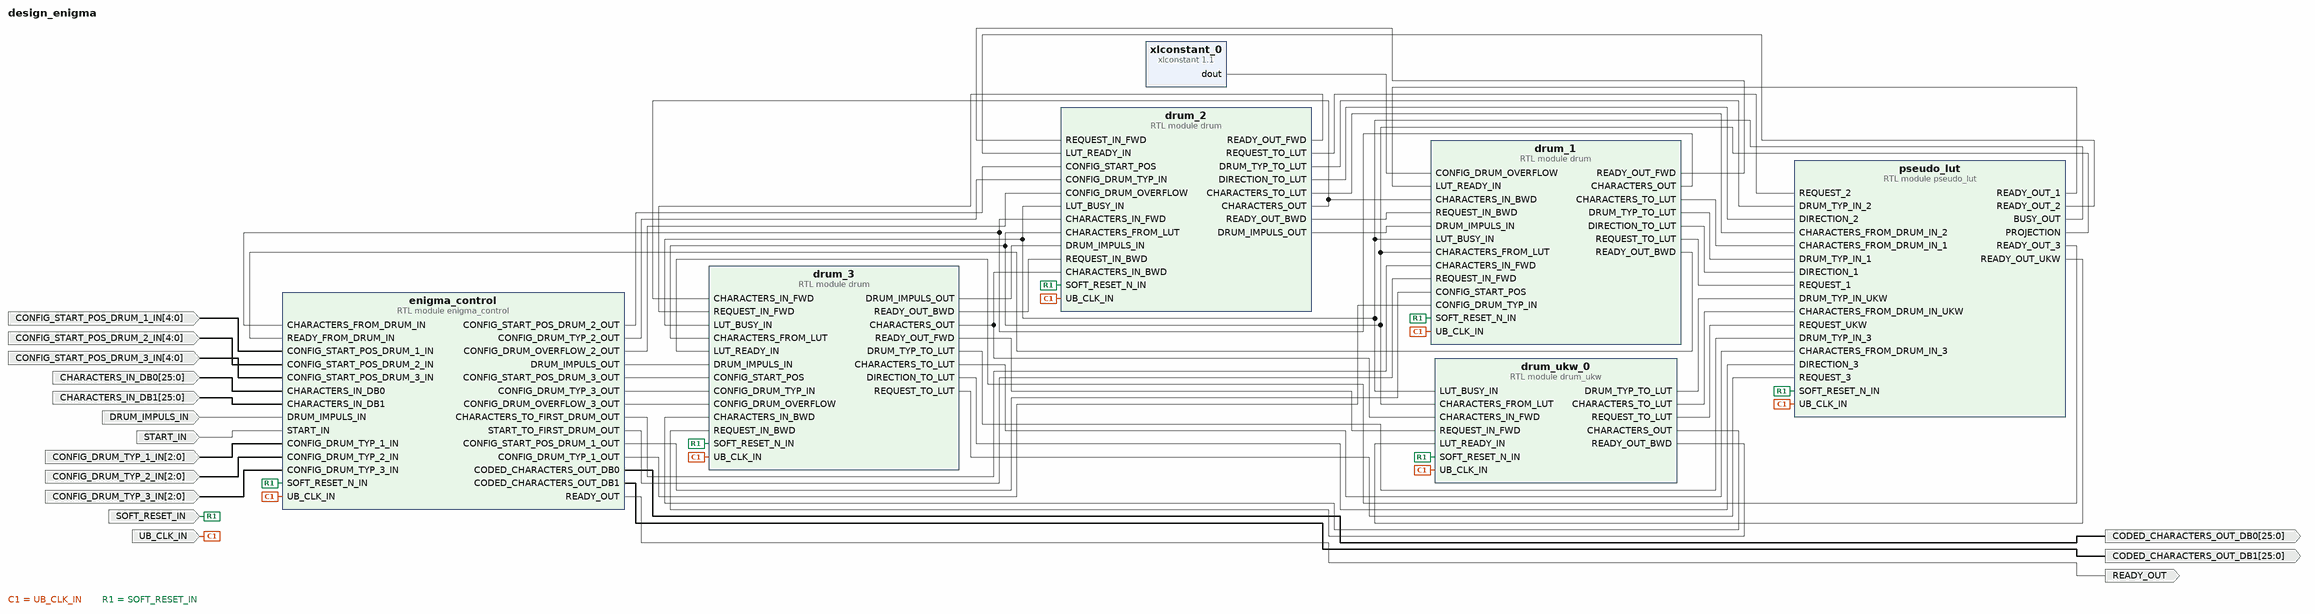
[diagram p0: block diagram of the top level]
# Vivado block design design_enigma, xc7z020clg400-1, Vivado 2018.3
create_bd_design design_enigma

create_bd_port -dir I -type clk UB_CLK_IN
set_property -dict {CONFIG.FREQ_HZ 100000000} [get_bd_ports UB_CLK_IN]
create_bd_port -dir I -type rst SOFT_RESET_IN
create_bd_port -dir I -from 4 -to 0 -type data CONFIG_START_POS_DRUM_1_IN
create_bd_port -dir I -from 4 -to 0 -type data CONFIG_START_POS_DRUM_2_IN
create_bd_port -dir I -from 4 -to 0 -type data CONFIG_START_POS_DRUM_3_IN
create_bd_port -dir I -from 25 -to 0 -type data CHARACTERS_IN_DB0
create_bd_port -dir I -from 25 -to 0 -type data CHARACTERS_IN_DB1
create_bd_port -dir I -type data DRUM_IMPULS_IN
create_bd_port -dir I -type data START_IN
create_bd_port -dir O -from 25 -to 0 -type data CODED_CHARACTERS_OUT_DB0
create_bd_port -dir O -from 25 -to 0 -type data CODED_CHARACTERS_OUT_DB1
create_bd_port -dir O -type data READY_OUT
create_bd_port -dir I -from 2 -to 0 -type data CONFIG_DRUM_TYP_1_IN
create_bd_port -dir I -from 2 -to 0 -type data CONFIG_DRUM_TYP_2_IN
create_bd_port -dir I -from 2 -to 0 -type data CONFIG_DRUM_TYP_3_IN

create_bd_cell -type ip -vlnv xilinx.com:ip:xlconstant:1.1 xlconstant_0
set_property -dict {CONFIG.CONST_VAL 0} [get_bd_cells xlconstant_0]
create_bd_cell -type module -reference pseudo_lut pseudo_lut
create_bd_cell -type module -reference drum drum_1
create_bd_cell -type module -reference drum drum_2
create_bd_cell -type module -reference drum drum_3
create_bd_cell -type module -reference drum_ukw drum_ukw_0
create_bd_cell -type module -reference enigma_control enigma_control

# ---- connections ----

connect_bd_net -net drum_0_CHARACTERS_TO_LUT [get_bd_pins drum_1/CHARACTERS_TO_LUT] [get_bd_pins pseudo_lut/CHARACTERS_FROM_DRUM_IN_1]
connect_bd_net -net drum_0_DRUM_TYP_TO_LUT [get_bd_pins drum_1/DRUM_TYP_TO_LUT] [get_bd_pins pseudo_lut/DRUM_TYP_IN_1]
connect_bd_net -net drum_0_DIRECTION_TO_LUT [get_bd_pins drum_1/DIRECTION_TO_LUT] [get_bd_pins pseudo_lut/DIRECTION_1]
connect_bd_net -net drum_0_REQUEST_TO_LUT [get_bd_pins drum_1/REQUEST_TO_LUT] [get_bd_pins pseudo_lut/REQUEST_1]
connect_bd_net -net drum_1_CHARACTERS_OUT [get_bd_pins drum_2/CHARACTERS_OUT] \
  [get_bd_pins drum_1/CHARACTERS_IN_BWD] [get_bd_pins drum_3/CHARACTERS_IN_FWD]
connect_bd_net -net drum_0_READY_OUT_FWD [get_bd_pins drum_1/READY_OUT_FWD] [get_bd_pins drum_2/REQUEST_IN_FWD]
connect_bd_net -net drum_1_READY_OUT_FWD [get_bd_pins drum_2/READY_OUT_FWD] [get_bd_pins drum_3/REQUEST_IN_FWD]
connect_bd_net -net drum_1_READY_OUT_BWD [get_bd_pins drum_2/READY_OUT_BWD] [get_bd_pins drum_1/REQUEST_IN_BWD]
connect_bd_net -net drum_1_DRUM_IMPULS_OUT [get_bd_pins drum_2/DRUM_IMPULS_OUT] [get_bd_pins drum_1/DRUM_IMPULS_IN]
connect_bd_net -net drum_2_DRUM_IMPULS_OUT [get_bd_pins drum_3/DRUM_IMPULS_OUT] [get_bd_pins drum_2/DRUM_IMPULS_IN]
connect_bd_net -net pseudo_lut_0_READY_OUT_1 [get_bd_pins pseudo_lut/READY_OUT_1] [get_bd_pins drum_1/LUT_READY_IN]
connect_bd_net -net pseudo_lut_0_BUSY_OUT [get_bd_pins pseudo_lut/BUSY_OUT] \
  [get_bd_pins drum_1/LUT_BUSY_IN] [get_bd_pins drum_2/LUT_BUSY_IN] [get_bd_pins drum_3/LUT_BUSY_IN] \
  [get_bd_pins drum_ukw_0/LUT_BUSY_IN]
connect_bd_net -net pseudo_lut_0_PROJECTION [get_bd_pins pseudo_lut/PROJECTION] \
  [get_bd_pins drum_1/CHARACTERS_FROM_LUT] [get_bd_pins drum_2/CHARACTERS_FROM_LUT] [get_bd_pins drum_3/CHARACTERS_FROM_LUT] \
  [get_bd_pins drum_ukw_0/CHARACTERS_FROM_LUT]
connect_bd_net -net pseudo_lut_0_READY_OUT_2 [get_bd_pins pseudo_lut/READY_OUT_2] [get_bd_pins drum_2/LUT_READY_IN]
connect_bd_net -net pseudo_lut_0_READY_OUT_3 [get_bd_pins pseudo_lut/READY_OUT_3] [get_bd_pins drum_3/LUT_READY_IN]
connect_bd_net -net pseudo_lut_0_READY_OUT_UKW [get_bd_pins pseudo_lut/READY_OUT_UKW] [get_bd_pins drum_ukw_0/LUT_READY_IN]
connect_bd_net -net drum_2_READY_OUT_BWD [get_bd_pins drum_3/READY_OUT_BWD] [get_bd_pins drum_2/REQUEST_IN_BWD]
connect_bd_net -net drum_2_CHARACTERS_OUT [get_bd_pins drum_3/CHARACTERS_OUT] \
  [get_bd_pins drum_2/CHARACTERS_IN_BWD] [get_bd_pins drum_ukw_0/CHARACTERS_IN_FWD]
connect_bd_net -net drum_1_REQUEST_TO_LUT [get_bd_pins drum_2/REQUEST_TO_LUT] [get_bd_pins pseudo_lut/REQUEST_2]
connect_bd_net -net drum_2_READY_OUT_FWD [get_bd_pins drum_3/READY_OUT_FWD] [get_bd_pins drum_ukw_0/REQUEST_IN_FWD]
connect_bd_net -net drum_2_DRUM_TYP_TO_LUT [get_bd_pins drum_3/DRUM_TYP_TO_LUT] [get_bd_pins pseudo_lut/DRUM_TYP_IN_3]
connect_bd_net [get_bd_pins drum_ukw_0/DRUM_TYP_TO_LUT] [get_bd_pins pseudo_lut/DRUM_TYP_IN_UKW]
connect_bd_net -net drum_1_DRUM_TYP_TO_LUT [get_bd_pins drum_2/DRUM_TYP_TO_LUT] [get_bd_pins pseudo_lut/DRUM_TYP_IN_2]
connect_bd_net -net drum_1_DIRECTION_TO_LUT [get_bd_pins drum_2/DIRECTION_TO_LUT] [get_bd_pins pseudo_lut/DIRECTION_2]
connect_bd_net -net drum_1_CHARACTERS_TO_LUT [get_bd_pins drum_2/CHARACTERS_TO_LUT] [get_bd_pins pseudo_lut/CHARACTERS_FROM_DRUM_IN_2]
connect_bd_net -net drum_2_CHARACTERS_TO_LUT [get_bd_pins drum_3/CHARACTERS_TO_LUT] [get_bd_pins pseudo_lut/CHARACTERS_FROM_DRUM_IN_3]
connect_bd_net -net drum_2_DIRECTION_TO_LUT [get_bd_pins drum_3/DIRECTION_TO_LUT] [get_bd_pins pseudo_lut/DIRECTION_3]
connect_bd_net -net drum_2_REQUEST_TO_LUT [get_bd_pins drum_3/REQUEST_TO_LUT] [get_bd_pins pseudo_lut/REQUEST_3]
connect_bd_net [get_bd_pins drum_ukw_0/CHARACTERS_TO_LUT] [get_bd_pins pseudo_lut/CHARACTERS_FROM_DRUM_IN_UKW]
connect_bd_net [get_bd_pins drum_ukw_0/REQUEST_TO_LUT] [get_bd_pins pseudo_lut/REQUEST_UKW]
connect_bd_net [get_bd_pins drum_ukw_0/CHARACTERS_OUT] [get_bd_pins drum_3/CHARACTERS_IN_BWD]
connect_bd_net -net drum_0_CHARACTERS_OUT [get_bd_pins drum_1/CHARACTERS_OUT] \
  [get_bd_pins drum_2/CHARACTERS_IN_FWD] [get_bd_pins enigma_control/CHARACTERS_FROM_DRUM_IN]
connect_bd_net [get_bd_pins drum_ukw_0/READY_OUT_BWD] [get_bd_pins drum_3/REQUEST_IN_BWD]
connect_bd_net -net enigma_control_0_CHARACTERS_TO_FIRST_DRUM_OUT [get_bd_pins enigma_control/CHARACTERS_TO_FIRST_DRUM_OUT] \
  [get_bd_pins drum_1/CHARACTERS_IN_FWD]
connect_bd_net -net enigma_control_0_START_TO_FIRST_DRUM_OUT [get_bd_pins enigma_control/START_TO_FIRST_DRUM_OUT] [get_bd_pins drum_1/REQUEST_IN_FWD]
connect_bd_net -net enigma_control_0_DRUM_IMPULS_OUT [get_bd_pins enigma_control/DRUM_IMPULS_OUT] [get_bd_pins drum_3/DRUM_IMPULS_IN]
connect_bd_net -net enigma_control_0_CONFIG_START_POS_DRUM_1_OUT [get_bd_pins enigma_control/CONFIG_START_POS_DRUM_1_OUT] \
  [get_bd_pins drum_1/CONFIG_START_POS]
connect_bd_net -net enigma_control_0_CONFIG_START_POS_DRUM_2_OUT [get_bd_pins enigma_control/CONFIG_START_POS_DRUM_2_OUT] \
  [get_bd_pins drum_2/CONFIG_START_POS]
connect_bd_net -net enigma_control_0_CONFIG_START_POS_DRUM_3_OUT [get_bd_pins enigma_control/CONFIG_START_POS_DRUM_3_OUT] \
  [get_bd_pins drum_3/CONFIG_START_POS]
connect_bd_net -net enigma_control_0_CONFIG_DRUM_TYP_1_OUT [get_bd_pins enigma_control/CONFIG_DRUM_TYP_1_OUT] [get_bd_pins drum_1/CONFIG_DRUM_TYP_IN]
connect_bd_net -net enigma_control_0_CONFIG_DRUM_TYP_2_OUT [get_bd_pins enigma_control/CONFIG_DRUM_TYP_2_OUT] [get_bd_pins drum_2/CONFIG_DRUM_TYP_IN]
connect_bd_net -net enigma_control_0_CONFIG_DRUM_TYP_3_OUT [get_bd_pins enigma_control/CONFIG_DRUM_TYP_3_OUT] [get_bd_pins drum_3/CONFIG_DRUM_TYP_IN]
connect_bd_net -net enigma_control_0_CONFIG_DRUM_OVERFLOW_2_OUT [get_bd_pins enigma_control/CONFIG_DRUM_OVERFLOW_2_OUT] \
  [get_bd_pins drum_2/CONFIG_DRUM_OVERFLOW]
connect_bd_net -net enigma_control_0_CONFIG_DRUM_OVERFLOW_3_OUT [get_bd_pins enigma_control/CONFIG_DRUM_OVERFLOW_3_OUT] \
  [get_bd_pins drum_3/CONFIG_DRUM_OVERFLOW]
connect_bd_net -net drum_0_READY_OUT_BWD [get_bd_pins drum_1/READY_OUT_BWD] [get_bd_pins enigma_control/READY_FROM_DRUM_IN]
connect_bd_net [get_bd_ports UB_CLK_IN] \
  [get_bd_pins pseudo_lut/UB_CLK_IN] [get_bd_pins drum_1/UB_CLK_IN] [get_bd_pins drum_2/UB_CLK_IN] \
  [get_bd_pins drum_3/UB_CLK_IN] [get_bd_pins drum_ukw_0/UB_CLK_IN] [get_bd_pins enigma_control/UB_CLK_IN]
connect_bd_net [get_bd_ports SOFT_RESET_IN] \
  [get_bd_pins pseudo_lut/SOFT_RESET_N_IN] [get_bd_pins drum_1/SOFT_RESET_N_IN] [get_bd_pins drum_2/SOFT_RESET_N_IN] \
  [get_bd_pins drum_3/SOFT_RESET_N_IN] [get_bd_pins drum_ukw_0/SOFT_RESET_N_IN] [get_bd_pins enigma_control/SOFT_RESET_N_IN]
connect_bd_net [get_bd_pins xlconstant_0/dout] [get_bd_pins drum_1/CONFIG_DRUM_OVERFLOW]
connect_bd_net [get_bd_ports CONFIG_START_POS_DRUM_1_IN] [get_bd_pins enigma_control/CONFIG_START_POS_DRUM_1_IN]
connect_bd_net [get_bd_ports CONFIG_START_POS_DRUM_2_IN] [get_bd_pins enigma_control/CONFIG_START_POS_DRUM_2_IN]
connect_bd_net [get_bd_ports CONFIG_START_POS_DRUM_3_IN] [get_bd_pins enigma_control/CONFIG_START_POS_DRUM_3_IN]
connect_bd_net -net CHARACTERS_IN_DB0_1 [get_bd_ports CHARACTERS_IN_DB0] [get_bd_pins enigma_control/CHARACTERS_IN_DB0]
connect_bd_net -net CHARACTERS_IN_DB1_1 [get_bd_ports CHARACTERS_IN_DB1] [get_bd_pins enigma_control/CHARACTERS_IN_DB1]
connect_bd_net [get_bd_ports DRUM_IMPULS_IN] [get_bd_pins enigma_control/DRUM_IMPULS_IN]
connect_bd_net [get_bd_ports START_IN] [get_bd_pins enigma_control/START_IN]
connect_bd_net -net enigma_control_CODED_CHARECTERS_OUT_DB0 [get_bd_pins enigma_control/CODED_CHARACTERS_OUT_DB0] \
  [get_bd_ports CODED_CHARACTERS_OUT_DB0]
connect_bd_net -net enigma_control_CODED_CHARECTERS_OUT_DB1 [get_bd_pins enigma_control/CODED_CHARACTERS_OUT_DB1] \
  [get_bd_ports CODED_CHARACTERS_OUT_DB1]
connect_bd_net [get_bd_pins enigma_control/READY_OUT] [get_bd_ports READY_OUT]
connect_bd_net [get_bd_ports CONFIG_DRUM_TYP_1_IN] [get_bd_pins enigma_control/CONFIG_DRUM_TYP_1_IN]
connect_bd_net [get_bd_ports CONFIG_DRUM_TYP_2_IN] [get_bd_pins enigma_control/CONFIG_DRUM_TYP_2_IN]
connect_bd_net [get_bd_ports CONFIG_DRUM_TYP_3_IN] [get_bd_pins enigma_control/CONFIG_DRUM_TYP_3_IN]

validate_bd_design
save_bd_design
